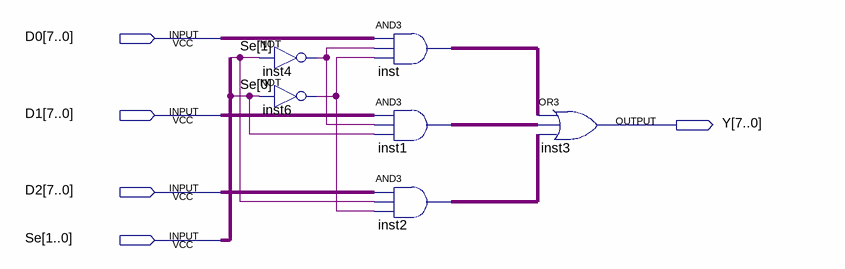
[diagram p0: schematic sheet]
// Quartus schematic 8mux31.bdf as structural Verilog: 6 symbols, 5 pins
module \8mux31  (
  input  [7:0] D0,
  input  [7:0] D1,
  input  [7:0] D2,
  input  [1:0] Se,
  output [7:0] Y
);

  wire inst4_out, inst6_out;
  wire [7:0] inst1_out, inst2_out, inst_out;

  not inst4 (inst4_out, Se[1]);
  not inst6 (inst6_out, Se[0]);
  assign inst_out = D0 & {8{inst4_out}} & {8{inst6_out}};  // AND3 inst, 8 bits wide
  assign inst1_out = D1 & {8{inst4_out}} & {8{Se[0]}};  // AND3 inst1, 8 bits wide
  assign inst2_out = D2 & {8{Se[1]}} & {8{inst6_out}};  // AND3 inst2, 8 bits wide
  assign Y = inst_out | inst1_out | inst2_out;  // OR3 inst3, 8 bits wide
endmodule
